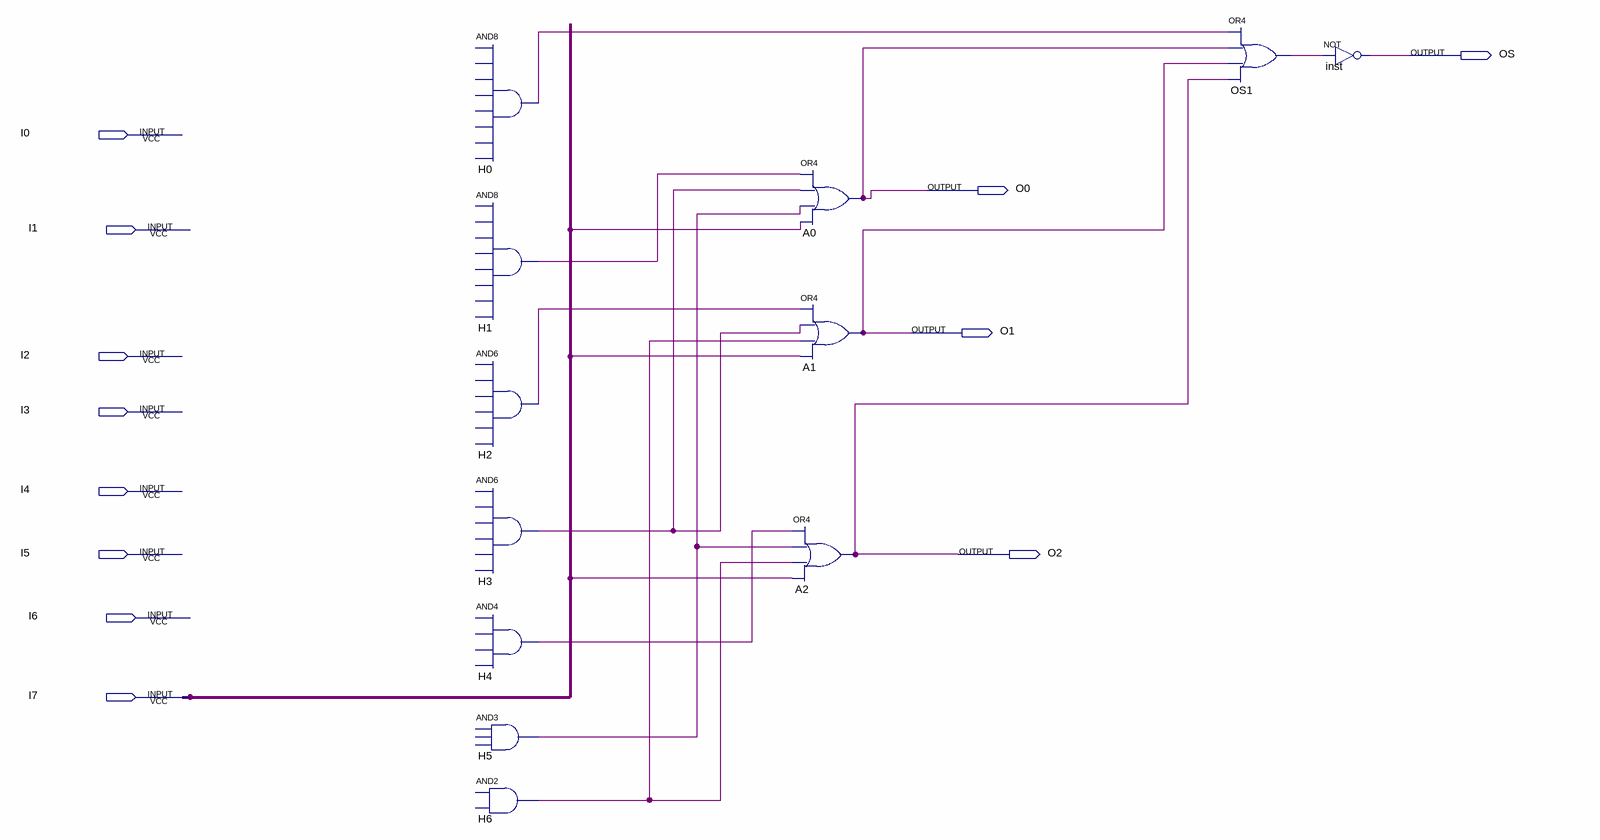
[diagram p0: schematic sheet]
// Quartus schematic EncoderDemo.bdf as structural Verilog: 12 symbols, 12 pins
module EncoderDemo (
  input  I0,
  input  I1,
  input  I2,
  input  I3,
  input  I4,
  input  I5,
  input  I6,
  input  I7,
  output OS,
  output O0,
  output O1,
  output O2
);

  wire H0_out, H1_out, H2_out, H3_out, H4_out, H5_out, H6_out, OS1_out;

  // AND8 H0 has open pins: IN1=open, IN2=open, IN3=open, IN4=open, IN5=open, IN6=open, IN7=open, IN8=open, OUT=H0_out
  // AND8 H1 has open pins: IN1=open, IN2=open, IN3=open, IN4=open, IN5=open, IN6=open, IN7=open, IN8=open, OUT=H1_out
  // AND6 H2 has open pins: IN1=open, IN2=open, IN3=open, IN4=open, IN5=open, IN6=open, OUT=H2_out
  // AND6 H3 has open pins: IN1=open, IN2=open, IN3=open, IN4=open, IN5=open, IN6=open, OUT=H3_out
  // AND4 H4 has open pins: IN1=open, IN2=open, IN3=open, IN4=open, OUT=H4_out
  // AND3 H5 has open pins: IN1=open, IN2=open, IN3=open, OUT=H5_out
  // AND2 H6 has open pins: IN1=open, IN2=open, OUT=H6_out
  or A2 (O2, H4_out, H5_out, H6_out, I7);
  or A0 (O0, H1_out, H3_out, H5_out, I7);
  or A1 (O1, H2_out, H3_out, H6_out, I7);
  or OS1 (OS1_out, H0_out, O0, O1, O2);
  not inst (OS, OS1_out);
endmodule
